# EAGLE board GPU (EAGLE 9.4.2), part 1 of 2
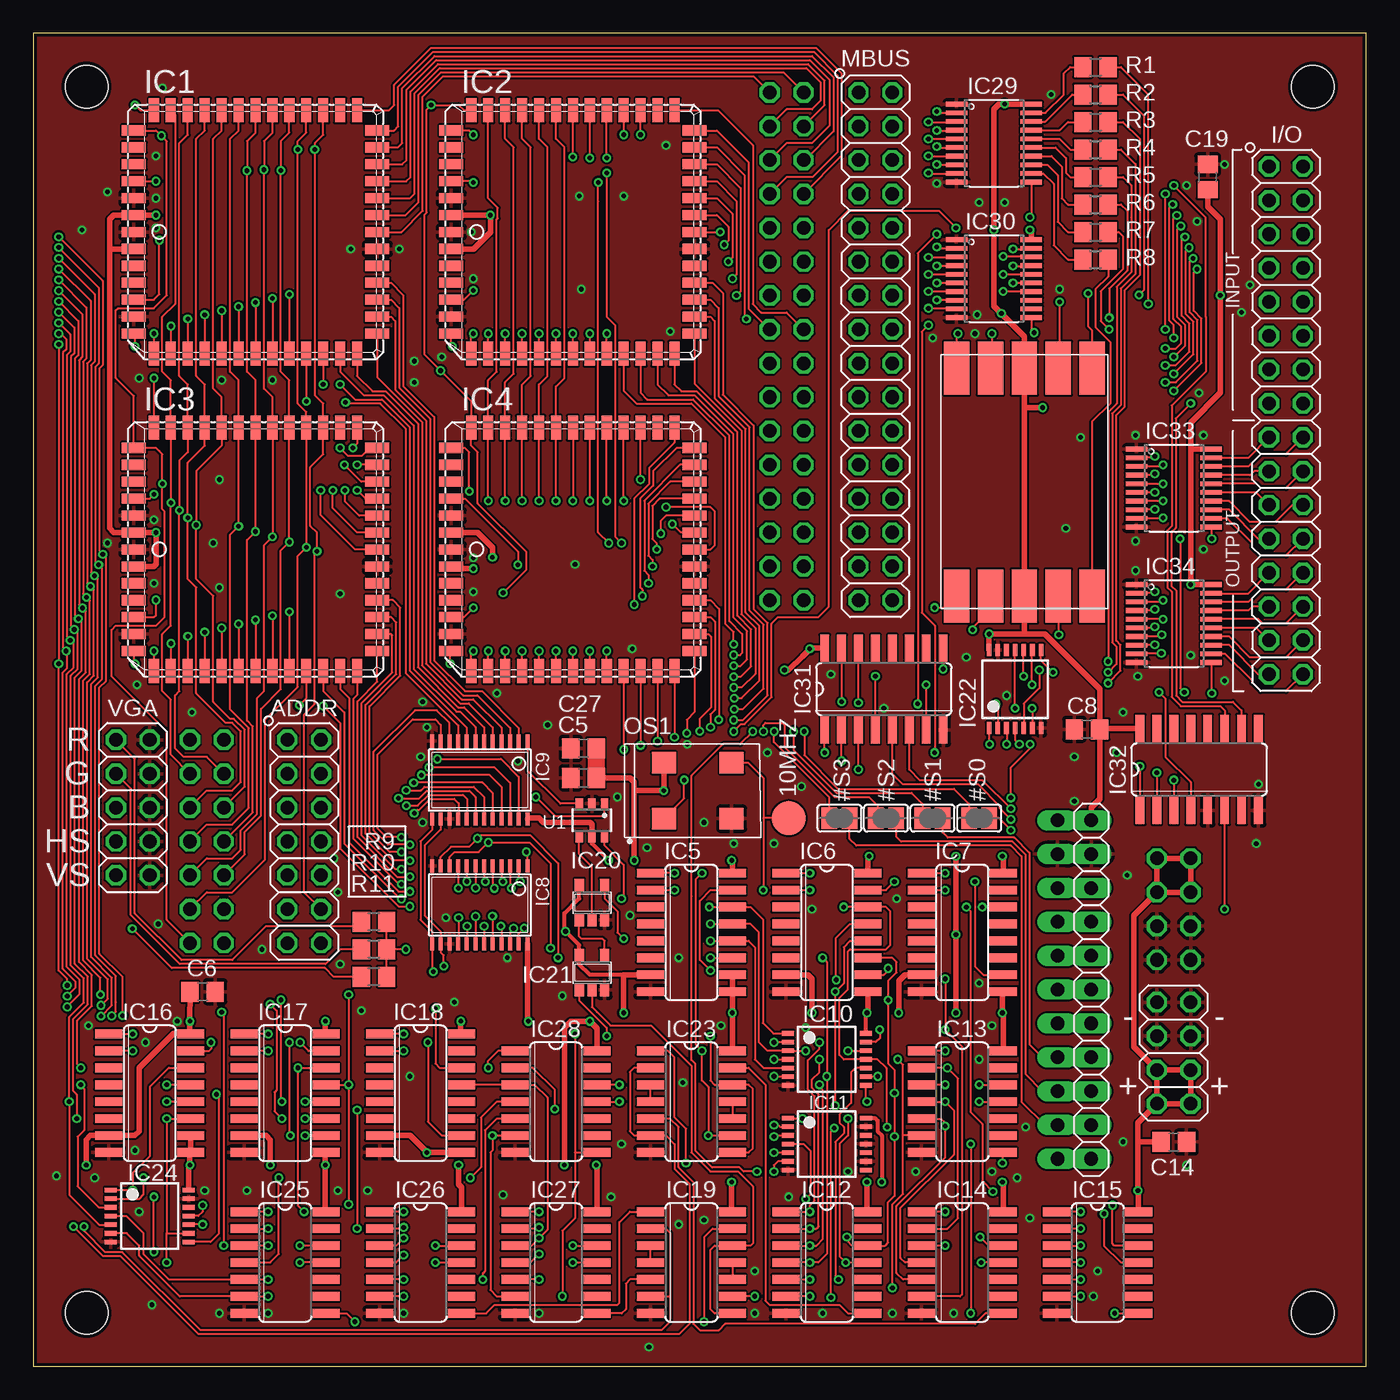
[diagram p5: board, top side]
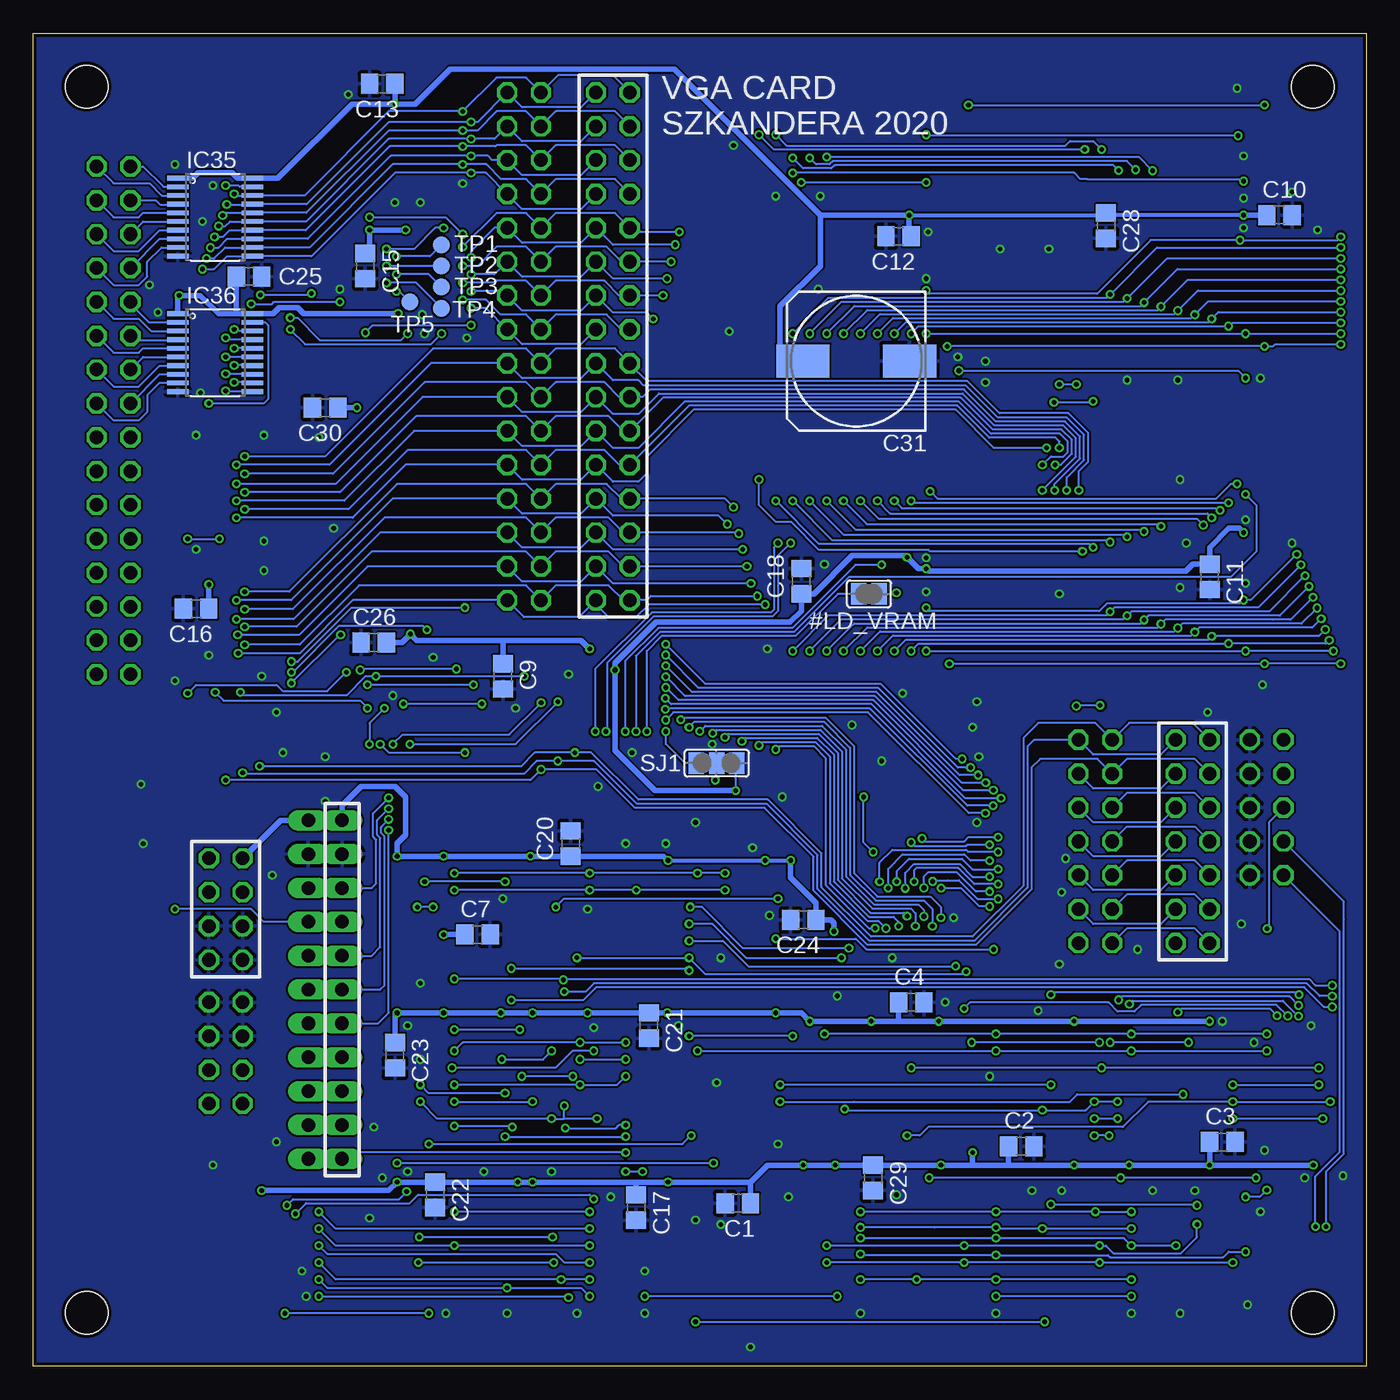
[diagram p6: board, bottom side, seen from below]

Size 100 x 100 mm. Coordinates in mm from the lower left corner, seen from the top.
Outline: 0,0 100,0 100,100 0,100 0,0
Copper layers (1*16): Top 0.035mm / dielectric 1.5mm / Bottom 0.035mm
Design rules "SeeedStudio_2layer_DRU_no_angle_20140221": minimum track width 6mil, minimum drill 12mil, track to track 6mil, track to pad 6mil, pad to pad 6mil, via to via 6mil, smd to smd 0mil, copper to edge 10mil, drill to drill 10mil, minimum pad ring 10mil, minimum via ring 6mil, stop-mask expansion 2mil, vias tented up to drill 100mil, thermal gap 10mil
Holes 3.2 mm at 4,4 96,4 4,96 96,96

## Footprints (pad centres in the part's own frame; a part is rotated, then mirrored left to right if it is on the bottom)
B2,54 = smd 2.54 x 2.54: TP 0,0
SJ = smd 1.168 x 1.6: 1 -0.762,0; 2 0.762,0
2X07 = drill 1.016 octagon: 1 -7.62,-1.27; 2 -7.62,1.27; 3 -5.08,-1.27; 4 -5.08,1.27; 5 -2.54,-1.27; 6 -2.54,1.27; 7 0,-1.27; 8 0,1.27; 9 2.54,-1.27; 10 2.54,1.27; 11 5.08,-1.27; 12 5.08,1.27; 13 7.62,-1.27; 14 7.62,1.27
C0805 = smd 1.3 x 1.5: 1 -0.95,0; 2 0.95,0
153CLV-1010 = smd 4 x 2.5: + 4,0; - -4,0
2X16 = drill 1.016 octagon: 1 -19.05,-1.27; 2 -19.05,1.27; 3 -16.51,-1.27; 4 -16.51,1.27; 5 -13.97,-1.27; 6 -13.97,1.27; 7 -11.43,-1.27; 8 -11.43,1.27; 9 -8.89,-1.27; 10 -8.89,1.27; 11 -6.35,-1.27; 12 -6.35,1.27; 13 -3.81,-1.27; 14 -3.81,1.27; 15 -1.27,-1.27; 16 -1.27,1.27; 17 1.27,-1.27; 18 1.27,1.27; 19 3.81,-1.27; 20 3.81,1.27; 21 6.35,-1.27; 22 6.35,1.27; 23 8.89,-1.27; 24 8.89,1.27; 25 11.43,-1.27; 26 11.43,1.27; 27 13.97,-1.27; 28 13.97,1.27; 29 16.51,-1.27; 30 16.51,1.27; 31 19.05,-1.27; 32 19.05,1.27
L52-1 = smd 1.8 x 0.76: 1 -9.13,0; 2 -9.13,-1.27; 3 -9.13,-2.54; 4 -9.13,-3.81; 5 -9.13,-5.08; 6 -9.13,-6.35; 7 -9.13,-7.62; 21 9.13,-7.62; 22 9.13,-6.35; 23 9.13,-5.08; 24 9.13,-3.81; 25 9.13,-2.54; 26 9.13,-1.27; 27 9.13,0; 28 9.13,1.27; 29 9.13,2.54; 30 9.13,3.81; 31 9.13,5.08; 32 9.13,6.35; 33 9.13,7.62; 47 -9.13,7.62; 48 -9.13,6.35; 49 -9.13,5.08; 50 -9.13,3.81; 51 -9.13,2.54; 52 -9.13,1.27 | smd 0.76 x 1.8: 8 -7.62,-9.13; 9 -6.35,-9.13; 10 -5.08,-9.13; 11 -3.81,-9.13; 12 -2.54,-9.13; 13 -1.27,-9.13; 14 0,-9.13; 15 1.27,-9.13; 16 2.54,-9.13; 17 3.81,-9.13; 18 5.08,-9.13; 19 6.35,-9.13; 20 7.62,-9.13; 34 7.62,9.13; 35 6.35,9.13; 36 5.08,9.13; 37 3.81,9.13; 38 2.54,9.13; 39 1.27,9.13; 40 0,9.13; 41 -1.27,9.13; 42 -2.54,9.13; 43 -3.81,9.13; 44 -5.08,9.13; 45 -6.35,9.13; 46 -7.62,9.13
SO16 = smd 0.66 x 2.032: 1 -4.445,-3.073; 2 -3.175,-3.073; 3 -1.905,-3.073; 4 -0.635,-3.073; 5 0.635,-3.073; 6 1.905,-3.073; 7 3.175,-3.073; 8 4.445,-3.073; 9 4.445,3.073; 10 3.175,3.073; 11 1.905,3.073; 12 0.635,3.073; 13 -0.635,3.073; 14 -1.905,3.073; 15 -3.175,3.073; 16 -4.445,3.073
TSSOP24 = smd 0.305 x 0.991: 1 -3.575,-2.918; 2 -2.925,-2.918; 3 -2.275,-2.918; 4 -1.625,-2.918; 5 -0.975,-2.918; 6 -0.325,-2.918; 7 0.325,-2.918; 8 0.975,-2.918; 9 1.625,-2.918; 10 2.275,-2.918; 11 2.925,-2.918; 12 3.575,-2.918; 13 3.575,2.918; 14 2.925,2.918; 15 2.275,2.918; 16 1.625,2.918; 17 0.975,2.918; 18 0.325,2.918; 19 -0.325,2.918; 20 -0.975,2.918; 21 -1.625,2.918; 22 -2.275,2.918; 23 -2.925,2.918; 24 -3.575,2.918
TSSOP14 = smd 0.35 x 0.9: 1 -1.95,-2.925; 2 -1.3,-2.925; 3 -0.65,-2.925; 4 0,-2.925; 5 0.65,-2.925; 6 1.3,-2.925; 7 1.95,-2.925; 8 1.95,2.925; 9 1.3,2.925; 10 0.65,2.925; 11 0,2.925; 12 -0.65,2.925; 13 -1.3,2.925; 14 -1.95,2.925
SO14 = smd 0.66 x 2.032: 1 -3.81,-3.073; 2 -2.54,-3.073; 3 -1.27,-3.073; 4 0,-3.073; 5 1.27,-3.073; 6 2.54,-3.073; 7 3.81,-3.073; 8 3.81,3.073; 9 2.54,3.073; 10 1.27,3.073; 11 0,3.073; 12 -1.27,3.073; 13 -2.54,3.073; 14 -3.81,3.073
SOT23-5 = smd 0.69 x 0.99: 1 -0.95,-1.29; 2 0,-1.29; 3 0.95,-1.29; 4 0.95,1.3; 5 -0.95,1.3
TSSOP20 = smd 0.35 x 1.6: 1 -2.925,-2.8; 2 -2.275,-2.8; 3 -1.625,-2.8; 4 -0.975,-2.8; 5 -0.325,-2.8; 6 0.325,-2.8; 7 0.975,-2.8; 8 1.625,-2.8; 9 2.275,-2.8; 10 2.925,-2.8; 11 2.925,2.8; 12 2.275,2.8; 13 1.625,2.8; 14 0.975,2.8; 15 0.325,2.8; 16 -0.325,2.8; 17 -0.975,2.8; 18 -1.625,2.8; 19 -2.275,2.8; 20 -2.925,2.8
1X11 = drill 1.016 long: 1 -12.7,0; 2 -10.16,0; 3 -7.62,0; 4 -5.08,0; 5 -2.54,0; 6 0,0; 7 2.54,0; 8 5.08,0; 9 7.62,0; 10 10.16,0; 11 12.7,0
7.2X5.2-4-PAD = smd 1.8 x 1.6: 1 -2.54,-2.1; 2 2.54,-2.1; 3 2.54,2.1; 4 -2.54,2.1
2X04 = drill 1.016 octagon: 1 -3.81,-1.27; 2 -3.81,1.27; 3 -1.27,-1.27; 4 -1.27,1.27; 5 1.27,-1.27; 6 1.27,1.27; 7 3.81,-1.27; 8 3.81,1.27
R0805 = smd 1.3 x 1.5: 1 -0.95,0; 2 0.95,0
SJ_2 = smd 1.168 x 1.6: 1 -1.524,0; 2 0,0; 3 1.524,0
B1,27 = smd 1.27 x 1.27: TP 0,0
SOT457 = smd 0.55 x 0.8: 1 -0.95,-1.25; 2 0,-1.25; 3 0.95,-1.25; 4 0.95,1.25; 5 0,1.25; 6 -0.95,1.25
OPS-S5621YG = smd 1.9 x 4: P$1 1.17,-1; P$2 3.71,-1; P$3 6.25,-1; P$4 8.79,-1; P$5 11.33,-1; P$6 1.17,-18.1; P$7 3.71,-18.1; P$8 6.25,-18.1; P$9 8.79,-18.1; P$10 11.33,-18.1
2X05 = drill 1.016 octagon: 1 -5.08,-1.27; 2 -5.08,1.27; 3 -2.54,-1.27; 4 -2.54,1.27; 5 0,-1.27; 6 0,1.27; 7 2.54,-1.27; 8 2.54,1.27; 9 5.08,-1.27; 10 5.08,1.27

## Placement (x,y rotation side)
10MHZ  PTR1B2,54  [B2,54]  56.67,41.12 0 top
#LD_VRAM  [SJ]  37.31,57.94 0 bottom
#S0  [SJ]  70.96,41.12 180 top
#S1  [SJ]  67.47,41.12 0 top
#S2  [SJ]  63.98,41.12 0 top
#S3  [SJ]  60.48,41.12 0 top
ADDR  [2X07]  13.02,39.37 270 top
ADDR_  [2X07]  20.32,39.37 270 top
C1  [C0805]  47.15,12.22 180 bottom
C2  [C0805]  25.88,16.51 0 bottom
C3  [C0805]  10.79,16.83 0 bottom
C4  [C0805]  34.13,27.3 0 bottom
C5  [C0805]  41.27,44.13 180 top
C6  [C0805]  12.7,28.1 0 top
C7  [C0805]  66.67,32.38 0 bottom
C8  [C0805]  79.06,47.78 180 top
C9  [C0805]  64.77,51.75 270 bottom
C10  [C0805]  6.51,86.36 0 bottom
C11  [C0805]  11.75,59.21 270 bottom
C12  [C0805]  35.08,84.77 180 bottom
C13  [C0805]  73.82,96.2 180 bottom
C14  [C0805]  85.57,16.83 0 top
C15  [C0805]  75.09,82.55 270 bottom
C16  [C0805]  87.79,56.83 180 bottom
C17  [C0805]  54.77,11.91 270 bottom
C18  [C0805]  42.39,58.9 90 bottom
C19  [C0805]  88.11,89.22 90 top
C20  [C0805]  59.69,39.21 90 bottom
C21  [C0805]  53.82,25.56 270 bottom
C22  [C0805]  69.85,12.86 270 bottom
C23  [C0805]  72.87,23.34 270 bottom
C24  [C0805]  42.23,33.5 180 bottom
C25  [C0805]  83.82,81.76 0 bottom
C26  [C0805]  74.45,54.29 180 bottom
C27  1u  [C0805]  41.27,46.35 180 top
C28  1u  [C0805]  19.53,85.57 270 bottom
C29  1u  [C0805]  36.99,14.13 270 bottom
C30  1u  [C0805]  78.11,71.91 180 bottom
C31  [153CLV-1010]  38.26,75.41 180 bottom
I/O  [2X16]  93.98,70.96 270 top
IC1  [L52-1]  16.67,85.09 0 top
IC2  [L52-1]  40.48,85.09 0 top
IC3  [L52-1]  16.67,61.28 0 top
IC4  [L52-1]  40.48,61.28 0 top
IC5  4161D  [SO16]  49.37,32.54 270 top
IC6  4161D  [SO16]  59.53,32.54 270 top
IC7  4161D  [SO16]  69.69,32.54 270 top
IC8  4067  [TSSOP24]  33.5,34.61 180 top
IC9  4067  [TSSOP24]  33.5,43.97 180 top
IC10  7404  [TSSOP14]  59.53,23.02 270 top
IC11  7404  [TSSOP14]  59.53,16.67 270 top
IC12  74AC30D  [SO14]  59.53,7.78 270 top
IC13  74AC30D  [SO14]  69.69,19.84 270 top
IC14  74AC30D  [SO14]  69.69,7.78 270 top
IC15  74AC30D  [SO14]  79.85,7.78 270 top
IC16  4161D  [SO16]  8.73,20.48 270 top
IC17  4161D  [SO16]  18.89,20.48 270 top
IC18  4161D  [SO16]  29.05,20.48 270 top
IC19  74AC00D  [SO14]  49.37,7.78 270 top
IC20  74AHC1G125DBV  [SOT23-5]  41.91,34.77 0 top
IC21  74AHC1G00DBV  [SOT23-5]  41.91,29.53 0 top
IC22  7404  [TSSOP14]  73.66,50.8 0 top
IC23  74AC00D  [SO14]  49.37,19.84 270 top
IC24  7404  [TSSOP14]  8.73,11.27 270 top
IC25  74AC30D  [SO14]  18.89,7.78 270 top
IC26  74AC30D  [SO14]  29.05,7.78 270 top
IC27  74AC30D  [SO14]  39.21,7.78 270 top
IC28  74AC30D  [SO14]  39.21,19.84 270 top
IC29  74574  [TSSOP20]  72.07,91.76 270 top
IC30  74574  [TSSOP20]  72.07,81.6 270 top
IC31  74AC138D  [SO16]  63.82,50.8 0 top
IC32  74AC138D  [SO16]  87.47,44.77 0 top
IC33  74574  [TSSOP20]  85.57,65.88 270 top
IC34  74574  [TSSOP20]  85.57,55.72 270 top
IC35  74245  [TSSOP20]  86.36,86.2 270 bottom
IC36  74245  [TSSOP20]  86.36,76.04 270 bottom
JP2  [1X11]  79.38,28.26 90 top
JP4  [1X11]  76.83,28.26 90 top
MBUS  [2X16]  56.52,76.52 270 top
MBUS1  [2X16]  63.18,76.52 270 top
OS1  OSC-OE-CFPS-72  [7.2X5.2-4-PAD]  49.85,43.18 0 top
PWR  [2X04]  85.57,34.29 270 top
PWR1  [2X04]  85.57,23.5 90 top
R1  [R0805]  79.69,97.47 0 top
R2  [R0805]  79.69,95.41 0 top
R3  [R0805]  79.69,93.34 0 top
R4  [R0805]  79.69,91.28 0 top
R5  [R0805]  79.69,89.22 0 top
R6  [R0805]  79.69,87.15 0 top
R7  [R0805]  79.69,85.09 0 top
R8  [R0805]  79.69,83.03 0 top
R9  [R0805]  25.56,33.34 180 top
R10  [R0805]  25.56,31.27 180 top
R11  [R0805]  25.56,29.21 180 top
SJ1  [SJ_2]  48.74,45.24 0 bottom
TP1  PTR1B1,27  [B1,27]  69.37,84.14 0 bottom
TP2  PTR1B1,27  [B1,27]  69.37,82.55 0 bottom
TP3  PTR1B1,27  [B1,27]  69.37,80.96 0 bottom
TP4  PTR1B1,27  [B1,27]  69.37,79.38 0 bottom
TP5  PTR1B1,27  [B1,27]  71.75,79.85 0 bottom
U1  SN74LVC1G157GV  [SOT457]  41.91,40.96 180 top
U$1  OPS-S5621YG  [OPS-S5621YG]  68.1,75.88 0 top
VGA  [2X05]  7.46,41.91 270 top

## Tracks (layer width: path | path; a pad name or v marks a point on that pad's centre or on a via)
#DISPLAY
  Top 0.152: IC21.4 42.86,31.91 42.7,32.07 41.12,32.07 40.96,32.23 IC20.1
#H0  (via drill 0.35)
  Top 0.152: IC12.1 v58.26,11.59 58.26,12.06 58.62,12.42 58.62,20.25 58.11,20.76 58.11,22.94 58.98,23.8 v58.98,24.29 | v68.42,11.59 IC14.1 | v68.42,23.65 IC13.1 | v55.56,24.29 55.59,24.32 IC10.2
  Bottom 0.152: v58.26,11.59 v68.42,11.59 | v68.42,23.65 67.79,24.29 v58.98,24.29 v55.56,24.29
#H1  (via drill 0.35)
  Top 0.152: IC12.2 v58.26,10.32 58.74,10.32 58.92,10.5 58.92,20.38 58.42,20.88 58.42,21.5 58.98,22.06 v58.98,23.02 | v78.58,11.59 IC15.1 | v55.56,23.02 IC10.4
  Bottom 0.152: v58.26,10.32 77.31,10.32 v78.58,11.59 | v58.98,23.02 v55.56,23.02
#H2  (via drill 0.35)
  Top 0.152: IC12.3 v58.26,9.05 58.74,9.05 59.23,9.54 59.23,20.7 58.98,20.95 v58.98,21.11 | v68.42,9.05 IC14.3 | v78.58,10.32 IC15.2 | v68.42,21.11 IC13.3 | v55.56,21.75 56.58,21.75 IC10.6
  Bottom 0.152: v58.26,9.05 v68.42,9.05 77.31,9.05 v78.58,10.32 | v68.42,21.11 v58.98,21.11 56.2,21.11 v55.56,21.75
#H3  (via drill 0.35)
  Top 0.152: IC13.4 v68.42,19.84 69.06,19.21 69.06,15.88 65.08,11.89 65.08,8.11 65.41,7.78 IC14.4 | v62.55,19.84 62.46,19.93 IC10.8
  Bottom 0.152: v68.42,19.84 v62.55,19.84
#H4  (via drill 0.35)
  Top 0.152: IC12.5 v58.26,6.51 | v78.58,7.78 IC15.4 | IC10.10 61.66,22.37 61.34,22.05 61.34,19.75 60.48,18.89 60.48,18.26 60.8,17.94 60.8,17.46 60.17,16.83 60.17,6.75 v60.41,6.51
  Bottom 0.152: v58.26,6.51 v60.41,6.51 77.31,6.51 v78.58,7.78
#H5  (via drill 0.35)
  Top 0.152: IC15.5 v78.58,6.51 | v58.26,5.24 IC12.6 | v61.12,23.65 61.13,23.67 IC10.12 | v64.45,5.87 64.45,12.13 65.25,12.93 65.25,17.3 | 65.25,17.3 65.25,22.62 v64.85,23.02 | IC13.6 65.25,17.3
  Bottom 0.152: v78.58,6.51 77.95,5.87 v64.45,5.87 58.9,5.87 v58.26,5.24 | v64.85,23.02 61.75,23.02 v61.12,23.65
#H6  (via drill 0.35)
  Top 0.152: IC15.6 v78.58,5.24 | v60.09,17.86 59.85,17.62 v59.85,5.16 | v55.56,18.1 55.88,18.1 56.01,17.97 IC11.2
  Bottom 0.152: v78.58,5.24 59.93,5.24 v59.85,5.16 | v55.56,18.1 56.04,18.1 56.28,17.86 v60.09,17.86
#H7  (via drill 0.35)
  Top 0.152: IC11.4 57.78,16.67 58.31,16.14 58.31,12.91 v57.94,12.54 | v80.33,11.43 80.33,9.05 81.6,7.78 IC15.11
  Bottom 0.152: v80.33,11.43 79.53,12.22 71.75,12.22 71.12,12.86 58.26,12.86 v57.94,12.54
#H_BLANK  (via drill 0.35)
  Top 0.152: IC23.8 53.66,16.03 53.98,16.35 53.98,20.8 53.66,21.11 IC23.12 51.12,21.11 50.8,21.43 50.8,24.45 v50.8,24.77 | IC21.1 40.96,27.46 43.02,25.4 v43.02,24.77
  Bottom 0.152: v43.02,24.77 v50.8,24.77
#H_MR  (via drill 0.35)
  Top 0.152: IC18.2 v27.78,23.65 | v17.62,23.65 IC17.2 | v7.46,23.65 IC16.2 | v48.1,36.99 IC5.1 | v81.12,3.97 IC15.8 | v70.33,16.67 v70.33,3.97 | IC23.9 v50.64,17.3 50.64,20.95 50.16,21.43 v50.16,23.65 49.69,24.13 49.69,36.51 v50.16,36.99 | IC7.1 v68.42,36.99 | IC6.1 v58.26,36.99
  Bottom 0.152: v27.78,23.65 27.62,23.65 | 27.62,23.65 v17.62,23.65 v7.46,23.65 | v48.1,36.99 v50.16,36.99 v58.26,36.99 v68.42,36.99 | v70.33,3.97 v81.12,3.97 | v70.33,16.67 51.28,16.67 v50.64,17.3 | v50.16,23.65 27.62,23.65
#LOAD_VRAM  (via drill 0.35)
  Top 0.152: IC2.46 32.3,94.22 31.91,94.61 v29.84,94.61 29.52,94.28 29.52,86.55 29.37,86.41 29.37,75.88 v30.56,74.69 32.86,72.39 IC4.46 32.86,69.06 33.34,68.58 33.34,64.72 36.99,61.07 36.99,59.77 v35.24,58.02 | v7.62,94.63 8.03,94.22 IC1.46 | v9.05,74.14 IC3.46 | IC11.6 55.85,15.37 55.56,15.08 v55.56,14.61 | v54.29,14.61 53.3,14.61 52.99,14.91 50.93,14.91 49.68,16.16 49.68,22.67 49.37,22.97 49.37,35.24 49.38,35.26 49.38,44.3 51.75,46.67 53.02,46.67 v53.98,47.62
  Bottom 0.152: v29.84,94.61 7.63,94.61 v7.62,94.63 | v30.56,74.69 9.6,74.69 v9.05,74.14 | v55.56,14.61 v54.29,14.61 | v53.98,47.62 53.98,53.66 52.85,54.78 42.81,54.78 39.64,57.94 #LD_VRAM.1 #LD_VRAM.2 35.56,57.94 35.48,58.02 v35.24,58.02
#STORE_VR0  (via drill 0.35)
  Top 0.152: v73.34,40.22 72.44,41.12 #S0.1 #S0.2 70.2,42.2 69.08,43.31 60.37,43.31 57.85,45.84 v57.85,47.62 | IC1.50 v9.21,88.9 | v43.02,89.53 43.02,78.74 43.66,78.11 43.66,62.23 v44.13,61.75
  Top 0.305: JP4.5 JP2.5
  Bottom 0.152: v44.13,61.75 44.45,61.44 44.45,56.76 44.65,56.56 53.59,56.56 57.85,52.3 v57.85,47.62 | JP4.5 74.14,25.72 73.34,26.51 v73.34,40.22 | v9.21,88.9 9.37,89.06 20.95,89.06 21.43,89.06 21.91,89.53 v43.02,89.53
#STORE_VR1  (via drill 0.35)
  Top 0.152: JP4.4 75.72,23.18 74.75,24.16 74.75,38.51 73.59,39.66 68.61,39.66 68.23,40.04 #S1.2 #S1.1 66.71,42.2 65.89,43.01 60.25,43.01 57.04,46.22 v57.04,47.62 | v43.18,61.75 42.39,62.55 42.39,87.39 v42.39,88.82 | v33.02,88.82 32.94,88.9 IC2.50
  Top 0.305: JP2.4 JP4.4
  Bottom 0.152: v43.18,61.75 44.13,60.8 44.13,56.65 44.53,56.26 53.46,56.26 56.95,52.77 56.95,47.72 v57.04,47.62 | v42.39,88.82 v33.02,88.82
#STORE_VR2  (via drill 0.35)
  Top 0.152: IC3.50 8.73,65.09 v9.05,65.41 | v54.78,47.62 54.78,48.12 54.93,48.26 56.2,48.26 56.36,48.1 56.36,46.47 60.12,42.7 62.71,42.7 63.34,42.07 63.34,41.12 | JP4.3 75.72,20.64 74.44,21.92 74.44,38.38 73.47,39.36 65.1,39.36 64.74,39.72 #S2.2 63.34,41.12 | 63.34,41.12 #S2.1
  Top 0.305: JP4.3 JP2.3
  Bottom 0.152: v9.05,65.41 8.26,64.61 8.26,61.12 10.16,59.21 38.8,59.21 42.93,55.09 52.98,55.09 54.78,53.28 v54.78,47.62
#STORE_VR3  (via drill 0.35)
  Top 0.152: IC4.50 32.38,65.09 36.35,61.12 v36.35,60.12 | JP4.2 75.88,18.1 74.14,19.84 74.14,38.26 73.34,39.05 61.75,39.05 61.25,39.56 #S3.2 #S3.1 59.72,42.67 55.56,46.83 55.56,47.6 v55.59,47.62
  Top 0.305: JP2.2 JP4.2
  Bottom 0.152: v36.35,60.12 38.33,60.12 43.06,55.39 53.1,55.39 55.59,52.91 v55.59,47.62
#TO_SP  (via drill 0.35)
  Top 0.152: IC31.4 v63.18,51.75 | v74.3,51.75 74.3,53.71 IC22.10 | v84.45,50.56 84.93,50.09 84.93,45.72 86.84,43.81 IC32.4
  Bottom 0.152: v63.18,51.75 v74.3,51.75 75.09,51.75 76.5,50.34 84.23,50.34 v84.45,50.56
#V0  (via drill 0.35)
  Top 0.152: IC24.2 7.97,12.57 8.26,12.86 v8.26,14.13 | IC28.4 34.77,19.84 33.59,18.66 33.59,14.92 v32.79,14.13 | IC25.4 17.78,7.78 18.41,8.41 v18.41,14.13
  Bottom 0.152: v8.26,14.13 v18.41,14.13 v32.79,14.13
#V1  (via drill 0.35)
  Top 0.152: v17.62,6.51 IC25.5 10.16,6.51 8.26,8.41 8.26,10 6.99,11.27 IC24.4 | v27.78,6.51 IC26.5 | v37.94,6.51 IC27.5 | IC28.5 34.77,18.57 33.89,17.7 33.89,7.14 33.73,6.99 v33.73,6.51
  Bottom 0.152: v17.62,6.51 v27.78,6.51 v33.73,6.51 v37.94,6.51
#V2  (via drill 0.35)
  Top 0.152: v17.62,5.24 IC25.6 11,5.24 7.95,8.29 7.95,9.04 7.01,9.97 IC24.6 | v27.78,5.24 IC26.6
  Bottom 0.152: v17.62,5.24 v27.78,5.24
#V3  (via drill 0.35)
  Top 0.152: IC28.11 v43.97,19.84 | v13.73,20.4 13.89,20.24 13.89,9.92 13.29,9.32 IC24.8
  Bottom 0.152: v43.97,19.84 38.42,19.84 22.23,19.84 21.67,20.4 v13.73,20.4
#V5  (via drill 0.35)
  Top 0.152: IC25.12 v20,9.05 | v30.16,9.05 IC26.12 | v40.48,9.05 IC27.12 | v12.7,10.64 11.75,10.64 11.73,10.62 IC24.10
  Bottom 0.152: v40.48,9.05 v30.16,9.05 v20,9.05 19.53,9.05 18.96,8.48 13.9,8.48 12.7,9.68 v12.7,10.64
#V_BLANK
  Top 0.152: IC19.8 51.12,3.97 50.8,4.29 50.8,8.73 51.12,9.05 IC19.12 53.82,9.05 53.98,9.21 53.98,13.49 52.86,14.61 50.8,14.61 49.37,16.03 49.37,22.54 46.35,25.56 43.29,25.56 42.28,26.57 41.91,26.94 IC21.2
#V_MR  (via drill 0.35)
  Top 0.152: IC16.1 v7.46,24.92 | v17.62,24.92 IC17.1 | v27.78,24.92 IC18.1 | v40.64,24.92 40.64,16.03 | 40.64,16.03 IC28.8 | v54.13,5.24 IC19.9 | 40.64,16.03 40.64,11.11 39.69,10.16 v39.69,5.24
  Bottom 0.152: v7.46,24.92 v17.62,24.92 v27.78,24.92 v40.64,24.92 | v39.69,5.24 v54.13,5.24
CLK  (via drill 0.35)
  Top 0.152: IC5.2 v48.1,35.72 | IC7.2 v68.42,35.72 | IC6.2 v58.26,35.72 | OS1.3 53.62,45.28 54.77,44.13 54.77,41.12 | 10MHZ.TP 54.77,41.12 | 54.77,41.12 v54.77,35.72
  Bottom 0.152: v48.1,35.72 v54.77,35.72 v58.26,35.72 v68.42,35.72
CLK_CPU  (via drill 0.35)
  Top 0.152: JP4.6 JP2.6 | v73.34,41.02 72.54,41.83 72.54,42.01 70.89,43.66 65.25,43.66 64.45,44.45 IC31.5
  Bottom 0.152: JP4.6 73.98,28.26 73.66,28.57 73.66,39.75 73.9,39.99 73.9,40.45 73.34,41 v73.34,41.02
CLK_EN  (via drill 0.35)
  Top 0.152: OS1.1 48.83,42.6 v48.83,43.97
  Bottom 0.152: SJ1.2 48.83,45.15 v48.83,43.97
CLK_EN_S  (via drill 0.35)
  Top 0.152: v52.55,47.62 53.1,48.18 53.37,48.18 55.39,50.2 55.39,55.71 55.88,56.2 58.9,56.2 59.69,56.99 59.69,85.25 61.12,86.68 67.94,86.68 v69.22,85.41 | v73.5,83.82 74.82,83.82 IC30.19
  Bottom 0.152: v69.22,85.41 69.85,85.41 71.44,83.82 v73.5,83.82 | SJ1.1 51.12,45.24 52.55,46.67 v52.55,47.62
COLOR  (via drill 0.35)
  Top 0.152: IC20.4 42.86,35.09 43.81,34.13 43.81,32.54 v44.29,32.07 | 26.51,31.43 R10.1 R9.1 | v27.94,31.27 26.67,31.27 26.51,31.43 | R11.1 26.51,31.43
  Bottom 0.152: v44.29,32.07 40.16,32.07 38.28,32.07 37.49,31.27 v27.94,31.27
COLOR_BLUE  (via drill 0.35)
  Top 0.152: R11.2 22.54,29.21 21.88,29.87 10.38,29.87 v7.43,32.83
  Bottom 0.152: VGA.5 7.3,40.8 7.3,32.95 v7.43,32.83
COLOR_GREEN
  Top 0.152: R10.2 23.02,31.27 21.92,30.18 10.99,30.18 7.32,33.85 7.32,43.33 VGA.3
COLOR_RED
  Top 0.152: VGA.1 7.62,45.56 7.62,33.97 11.11,30.48 14.92,30.48 17.46,33.02 24.61,33.02 R9.2
GND  (via drill 0.35)
  other vias: 43.81,42.7 38.58,48.1 29.21,49.85 29.53,47.94 29.21,40.8 36.35,45.4 46.04,38.89 52.55,39.21 57.63,43.5 58.42,34.29 48.42,30.64 44.77,33.81 39.69,27.78 24.61,26.67 28.26,21.75 35.24,12.86 17.62,3.97 27.78,3.97 37.94,3.97 54.13,3.97 59.21,3.97 54.13,7.14 46.2,1.43 43.34,12.7 56.67,12.7 66.2,14.61 71.91,14.61 74.77,11.11 74.45,17.94 70.96,23.02 71.91,25.56 70.96,28.73 64.77,35.08 57.94,25.4 51.59,25.56 48.74,21.27 64.45,3.97 69.06,3.97 79.53,5.24 7.94,11.59 12.86,13.18 7.62,16.19 8.41,24.29 10.79,25.88 4.13,25.56 9.37,33.18 22.54,38.1 29.05,45.72 50.32,40.8 55.09,46.04 49.05,46.67 59.85,51.91 82.71,61.91 82.87,51.75 87.79,61.28 87.79,69.85 78.58,69.69 70.64,77.47 70.8,78.9 70.96,87.31 72.87,87.31 76.99,80.8 87.31,85.88 86.52,88.58 91.28,81.12 67.79,88.74 67.47,77.15 47.47,91.6 33.02,81.6 32.86,85.09 27.46,83.82 47.78,77.63 23.81,83.82 9.21,90.81 9.21,87.63 9.21,85.41 3.65,85.25 7.94,74.14 5.56,61.75 9.05,63.5 9.05,58.74 33.02,58.1 33.02,60.64 17.94,73.98 14.13,73.98 91.92,43.66 78.11,42.39 63.82,49.37 70.01,53.18 77.47,62.87 44.93,53.82 34.77,50.48 55.56,39.21 73.03,50.32 86.84,53.34 82.71,59.69 82.71,69.85 76.36,95.41 31.59,27.3 30.96,33.66 35.56,30.64 4.6,14.13 13.97,3.97 25.08,13.18 22.86,13.18 48.42,10.64 50.32,10.95 73.82,14.13 89.38,90.17 90.65,79.06 87.47,73.03 78.11,45.72 61.12,14.61 40.64,60.17 13.97,66.52 13.49,61.75 13.97,58.42 23.02,57.94 11.91,49.05 22.86,35.56 23.02,30.16 17.14,31.27 44.13,16.67 16.03,13.18 8.89,4.6 1.75,14.29 79.85,7.14 86.52,15.08 81.76,16.83 82.07,36.83 91.76,39.21 81.28,46.04 81.76,49.05 89.38,51.44 9.68,95.89 5.56,88.11 7.78,51.12 40.96,87.79 44.29,87.79 41.12,80.8 28.57,75.41 28.57,73.82 30.64,75.72
  pour Top: -4.13,107.16 105.57,107.16 105.57,48.58 105.57,-4.76 32.38,-4.76 -4.13,-4.76
  pour Bottom: -4.76,107.63 107.47,107.63 107.47,11.27 107.47,-6.51 20.16,-6.51 -4.76,-6.51
H0  (via drill 0.35)
  Top 0.152: IC5.14 52.7,34.45 | 52.7,34.45 53.82,34.45 54.45,33.81 54.74,33.52 54.74,25.74 55.52,24.97 IC10.1 | IC9.10 31.22,48.26 30.27,49.21 28.64,49.21 25.53,46.1 25.53,40.21 26.61,39.13 v28.26,39.13 | IC8.10 31.22,38.21 31.59,38.58 33.42,38.58 v34.13,39.29 37.23,39.29 38.81,37.71 v38.81,31.36 | v50.72,34.45 52.7,34.45
  Bottom 0.152: v34.13,39.29 33.88,39.04 30,39.04 29.91,39.13 v28.26,39.13 | v38.81,31.36 46.75,31.36 49.84,34.45 v50.72,34.45
H1  (via drill 0.35)
  Top 0.152: IC14.2 68.58,10.32 69.37,11.11 69.37,21.59 v68.58,22.38 IC13.2 | v57.94,23.65 57.93,23.67 IC10.3 55.07,23.67 54.44,24.3 54.44,32.56 53.82,33.18 IC5.13 v50.8,33.18 | IC8.11 30.57,38.19 31.34,38.96 32.69,38.96 v33.32,39.6 33.58,39.85 37.26,39.85 39.37,37.74 v39.37,30.64 | v27.62,39.69 26.48,39.69 25.84,40.33 25.84,45.9 28.46,48.53 30.16,48.53 30.57,48.12 IC9.11
  Bottom 0.152: v57.94,23.65 59.53,23.65 60.8,22.38 61.91,22.38 v68.58,22.38 | v33.32,39.6 33.1,39.37 30.16,39.37 29.84,39.69 v27.62,39.69 | v39.37,30.64 46.51,30.64 49.05,33.18 v50.8,33.18
H2  (via drill 0.35)
  Top 0.152: IC10.5 54.78,22.37 54.13,23.02 54.13,31.43 53.66,31.91 IC5.12 v50.8,31.91 | IC9.14 30.57,40.26 29.37,39.05 29.37,33.81 30.57,32.61 IC8.14 30.57,31.05 30.8,30.83 v30.8,30
  Bottom 0.152: v50.8,31.91 48.26,31.91 46.36,30 v30.8,30
H3  (via drill 0.35)
  Top 0.152: IC15.3 v78.58,9.05 | IC12.4 v58.26,7.78 58.9,7.78 59.53,8.41 v59.53,21.75 59.53,30.32 v59.21,30.64 | v63.34,21.75 63.31,21.72 IC10.9 | v50.8,30.64 IC5.11 | IC9.13 29.92,40.24 29.05,39.37 29.05,33.5 29.92,32.63 IC8.13 29.92,29.69 v30,29.61
  Bottom 0.152: v78.58,9.05 77.95,8.41 60.8,8.41 60.17,7.78 v58.26,7.78 | v59.53,21.75 v63.34,21.75 | v59.21,30.64 v50.8,30.64 49.61,29.45 30.16,29.45 v30,29.61
H4  (via drill 0.35)
  Top 0.152: IC13.5 68.1,18.57 68.42,18.26 v68.42,18.02 68.42,15.67 64.77,12.02 64.77,6.99 65.25,6.51 IC14.5 | v64.06,17.94 63.99,18 63.99,22.37 63.34,23.02 IC10.11 60.8,23.02 60.47,23.35 60.47,27.62 61.11,28.25 61.11,31.1 61.28,31.27 63.98,31.27 64.29,31.59 64.29,34.13 63.98,34.45 IC6.14 v60.8,34.45 | v44.13,35.08 44.29,35.24 44.29,37.62 42.86,39.05 U1.6
  Bottom 0.152: v68.42,18.02 64.13,18.02 v64.06,17.94 | v60.8,34.45 60.17,35.08 v44.13,35.08
H5  (via drill 0.35)
  Top 0.152: IC1.7 7.62,77.39 v7.62,76.52 | v31.43,76.52 31.35,76.6 IC2.7 | IC3.7 7.54,52.79 v7.62,52.7 | v31.27,52.7 31.27,53.58 IC4.7 | v1.91,76.66 v1.91,52.7 1.91,29.69 2.54,29.05 v2.54,28.57 | v63.5,25.24 63.5,24.61 63.21,24.32 IC10.13 | IC14.6 69.53,5.24 69.68,5.38 69.68,23.98 v68.42,25.24 v68.42,29.05 | v60.23,28.99 60.23,32.13 61.28,33.18 IC6.13
  Bottom 0.152: v31.43,76.52 v7.62,76.52 6.97,76.52 6.83,76.66 v1.91,76.66 | v1.91,52.7 v7.62,52.7 v31.27,52.7 | v2.54,28.57 3.81,28.57 4.29,29.05 60.17,29.05 v60.23,28.99 60.3,29.05 v68.42,29.05 | v63.5,25.24 v68.42,25.24
H6  (via drill 0.35)
  Top 0.152: IC2.8 32.86,77.31 v33.02,77.47 | v9.05,77.47 IC1.8 | IC4.8 32.86,53.5 v33.02,53.66 | v9.05,53.66 IC3.8 | v1.91,77.47 2.06,77.47 2.46,77.07 2.46,76.28 2.21,76.03 2.21,53.91 v2.46,53.66 2.54,53.58 2.54,52.39 2.21,52.06 2.21,29.81 3.17,28.85 3.17,28.4 v2.54,27.77 | IC14.11 v71.12,7.78 | IC12.11 v60.96,7.78 60.48,8.26 60.48,16.67 61.12,17.3 v61.12,18.57 | v70.96,19.84 IC13.11 | v57.7,18.57 56.65,18.57 IC11.1 | IC6.12 61.28,31.91 60.8,31.43 60.8,28.73 v60.17,28.1 60.17,26.99 v60.17,19.53
  Bottom 0.152: v33.02,77.47 v9.05,77.47 v1.91,77.47 | v33.02,53.66 v9.05,53.66 v2.46,53.66 | v2.54,27.77 3.49,27.77 4.46,28.73 57.94,28.73 58.58,28.1 v60.17,28.1 | v71.12,7.78 v60.96,7.78 | v70.96,19.84 69.69,18.57 v61.12,18.57 60.17,18.57 | v57.7,18.57 60.17,18.57 | 60.17,18.57 v60.17,19.53
H7  (via drill 0.35)
  Top 0.152: IC2.9 v34.13,77.47 | v10.32,78.03 IC1.9 | IC4.9 v34.13,53.66 | v10.32,54.21 IC3.9 | v1.91,78.28 2.77,77.42 2.77,76.11 2.52,75.86 2.52,54.72 v2.77,54.47 3.02,54.21 3.02,52.43 2.52,51.93 2.52,29.94 3.48,28.97 3.48,27.92 2.54,26.98 v2.54,26.96 | v71.04,9.68 71.68,9.05 IC14.12 | v55.56,17.23 55.66,17.32 IC11.3 | v70.96,21.11 IC13.12 | v61.04,9.68 61.04,9.45 61.44,9.05 IC12.12 63.9,9.05 64.14,9.29 64.14,12.3 64.61,12.78 v64.61,17.23 v64.61,20.48 64.61,22.23 64.14,22.7 v64.14,27.46 64.14,28.89 64.77,29.53 64.77,30.32 64.45,30.64 IC6.11
  Bottom 0.152: v34.13,77.47 33.58,78.03 v10.32,78.03 10.25,78.03 10,78.28 v1.91,78.28 | v34.13,53.66 33.58,54.21 v10.32,54.21 3.02,54.21 v2.77,54.47 | v64.61,17.23 v55.56,17.23 | v64.61,20.48 70.33,20.48 v70.96,21.11 | v61.04,9.68 v71.04,9.68 | v64.14,27.46 58.74,27.46 57.77,28.43 4.64,28.43 3.17,26.96 v2.54,26.96
H8  (via drill 0.35)
  Top 0.152: IC15.12 81.12,9.05 80.96,9.21 80.96,12.05 v80.98,12.06 | v71.99,13.1 71.2,13.89 71.2,18.18 70.33,19.05 70.33,34.13 v70.01,34.45 | v71.2,34.45 IC7.14
  Bottom 0.152: v80.98,12.06 80.51,12.53 72.56,12.53 v71.99,13.1 | v70.01,34.45 v71.2,34.45
H_COMP_0
  Top 0.152: IC23.13 53.66,22.38 54.93,21.11 54.93,4.92 55.24,4.6 60.48,4.6 61.12,3.97 IC12.8
H_COMP_1  (via drill 0.35)
  Top 0.152: IC13.8 72.71,15.98 v72.71,15.24 | v48.98,15.24 48.98,17.81 48.1,18.69 48.1,23.18 47.62,23.65 IC23.1
  Bottom 0.152: v72.71,15.24 v48.98,15.24
H_COMP_2
  Top 0.152: IC14.8 71.44,3.97 70.64,3.17 51.91,3.17 51.44,2.7 50.01,2.7 49.53,3.17 49.53,13.81 48.42,14.92 48.42,17.94 47.78,18.57 IC23.5
H_SYNC  (via drill 0.35)
  Top 0.152: IC23.2 45.09,22.38 44.77,22.07 44.77,17.62 45.09,17.3 IC23.6 47.47,17.3 48.11,16.66 48.11,14.8 49.21,13.7 49.21,3.17 48.43,2.39 12.41,2.39 6.55,8.26 5.22,8.26 v3,10.48
  Bottom 0.152: v3,10.48 3,14.62 1.68,15.94 1.68,33.5 1.68,34.86 VGA.7
H_SYNC1
  Top 0.152: IC23.11 IC23.10
H_SYNC2
  Top 0.152: IC19.11 IC19.10
INPP_EN_0  (via drill 0.35)
  Top 0.152: v85.57,88.58 87.95,86.2 87.95,78.74 87.95,74.62 85.41,72.07 85.41,63.02 85.09,62.71 85.09,58.42 85.41,58.1 85.41,50.21 86.09,49.53 89.06,49.53 89.38,49.21 IC32.11
  Bottom 0.152: IC35.19 84.51,88.48 84.61,88.58 v85.57,88.58
INPP_EN_1  (via drill 0.35)
  Top 0.152: v86.84,72.23 85.71,71.11 85.71,62.9 85.39,62.58 85.39,58.55 85.74,58.2 85.74,50.31 86.2,49.85 90.01,49.85 90.65,49.21 IC32.10
  Bottom 0.152: IC36.19 82.6,78.32 82.39,78.11 82.39,72.55 82.71,72.23 v86.84,72.23
LOAD  (via drill 0.35)
  Top 0.152: v89.38,34.29 IC32.6
  Top 0.305: JP2.8 JP4.8
  Bottom 0.152: JP2.8 82.71,33.34 83.66,34.29 v89.38,34.29
LOAD_VRAM  (via drill 0.35)
  Top 0.152: IC11.5 55.58,16.02 v55.56,16.03
  Top 0.305: JP4.1 JP2.1
  Bottom 0.152: v55.56,16.03 76.36,16.03 JP4.1
LOWER_BIT
  Top 0.152: IC9.1 37.09,46.88 37.09,44.67 39.55,42.21 U1.3
MB0  (via drill 0.35)
  Top 0.152: IC1.27 27.62,85.09 29.21,86.68 29.21,95.25 30.73,96.77 54.04,96.77 MBUS.1 | v67.79,94.14 67.89,94.03 IC29.2 | v84.93,77.79 v84.93,87.95
  Bottom 0.152: MBUS.1 56.52,96.84 60.64,96.84 MBUS1.1 63.02,96.68 65.25,96.68 v67.79,94.14 73.34,94.14 79.66,87.83 IC35.18 84.81,87.83 v84.93,87.95 | IC36.18 84.81,77.67 v84.93,77.79
MB1  (via drill 0.35)
  Top 0.152: IC1.28 27.94,86.36 28.91,87.33 28.91,95.38 30.61,97.08 56.27,97.08 MBUS.2 | v67.15,93.34 69.23,93.34 IC29.3 | v85.57,77.15 85.57,78.11 85.24,78.44 85.24,86.9 v85.49,87.15
  Bottom 0.152: MBUS.2 58.91,94.44 63.33,94.44 MBUS1.2 66.67,93.34 v67.15,93.34 73.34,93.34 79.51,87.18 IC35.17 83.58,87.15 v85.49,87.15 | IC36.17 85.43,77.02 v85.57,77.15
MB2  (via drill 0.35)
  Top 0.152: IC1.29 28.26,87.63 28.6,87.97 28.6,95.5 30.48,97.38 58,97.38 59.07,96.32 59.07,94.94 58.42,94.3 56.52,94.3 MBUS.3 | v67.79,92.71 69.25,92.71 IC29.4 | v84.93,76.36 85.72,76.36 86.12,76.76 86.12,77.98 85.54,78.56 85.54,86.09 v85.79,86.35
  Bottom 0.152: MBUS.3 56.36,94.14 60.8,94.14 MBUS1.3 63.02,94.14 65.25,94.14 66.67,92.71 v67.79,92.71 73.34,92.71 79.53,86.53 IC35.16 85.61,86.53 v85.79,86.35 | IC36.16 v84.92,76.37 v84.93,76.36
MB3  (via drill 0.35)
  Top 0.152: IC1.30 27.98,88.9 28.3,89.22 28.3,95.63 30.36,97.69 58.13,97.69 59.37,96.44 59.37,94.61 MBUS.4 | v67.15,92.08 IC29.5 | v85.57,75.72 86.43,76.58 86.43,78.11 85.85,78.69 85.85,85.29 v86.1,85.54
  Bottom 0.152: MBUS.4 58.91,91.9 63.33,91.9 MBUS1.4 65.41,92.08 v67.15,92.08 73.34,92.08 79.54,85.88 IC35.15 85.25,85.88 85.59,85.54 v86.1,85.54 | IC36.15 v85.57,75.72
MB4  (via drill 0.35)
  Top 0.152: IC1.31 27.67,90.17 27.99,90.49 27.99,95.75 30.23,97.99 58.26,97.99 59.73,96.52 59.73,93.07 58.42,91.76 56.52,91.76 MBUS.5 | v67.79,91.52 67.87,91.43 IC29.6 | v86.4,84.73 86.15,84.48 86.15,78.81 86.73,78.23 86.73,76.1 85.72,75.09 v84.93,75.09
  Bottom 0.152: MBUS.5 56.36,91.6 60.8,91.6 MBUS1.5 63.02,91.6 65.25,91.6 65.33,91.52 v67.79,91.52 73.26,91.52 79.56,85.23 IC35.14 85.27,85.23 85.77,84.73 v86.4,84.73 | IC36.14 83.58,75.09 v84.93,75.09
MB5  (via drill 0.35)
  Top 0.152: IC1.32 27.37,91.44 27.69,91.76 27.69,95.88 30.1,98.3 58.43,98.3 60.03,96.7 60.03,92.64 57.88,90.49 MBUS.6 | v67.15,90.81 67.17,90.78 IC29.7 | v85.57,74.45 87.04,75.92 87.04,78.36 86.45,78.94 86.45,83.67 v86.71,83.92
  Bottom 0.152: MBUS.6 58.91,89.36 63.33,89.36 MBUS1.6 65.56,90.49 65.88,90.81 v67.15,90.81 73.18,90.81 79.41,84.58 IC35.13 85.44,84.58 86.1,83.92 v86.71,83.92 | IC36.13 85.53,74.42 v85.57,74.45
MB6  (via drill 0.35)
  Top 0.152: IC1.33 27.06,92.71 27.38,93.03 27.38,96.01 29.98,98.6 58.56,98.6 60.34,96.83 60.34,91.09 58.47,89.22 56.52,89.22 MBUS.7 | v67.79,90.17 67.82,90.13 IC29.8 | v84.93,73.82 85.72,73.82 87.34,75.44 87.34,78.48 86.76,79.07 86.76,82.87 v87.01,83.12
  Bottom 0.152: MBUS.7 56.36,89.06 60.8,89.06 MBUS1.7 63.02,89.06 64.9,89.06 66.01,90.17 v67.79,90.17 73.03,90.17 79.27,83.93 IC35.12 85.62,83.93 86.43,83.12 v87.01,83.12 | IC36.12 83.61,73.82 v84.93,73.82
MB7  (via drill 0.35)
  Top 0.152: IC1.34 26.68,94.22 27.08,94.61 27.08,96.13 29.85,98.91 58.73,98.91 60.64,97 60.64,90.81 MBUS.8 | v67.15,89.53 67.2,89.48 IC29.9 | v85.57,73.18 87.65,75.26 87.65,78.61 87.06,79.19 87.06,82.06 v87.32,82.31
  Bottom 0.152: MBUS.8 58.91,86.82 63.33,86.82 MBUS1.8 66.04,89.53 v67.15,89.53 72.87,89.53 79.12,83.28 IC35.11 85.47,83.28 86.44,82.31 v87.32,82.31 | IC36.11 85.5,73.12 v85.57,73.18
MB8  (via drill 0.35)
  Top 0.152: IC2.27 v51.54,85.09 | v67.79,83.98 67.89,83.87 IC30.2
  Bottom 0.152: v51.54,85.09 54.93,85.09 MBUS.9 56.36,86.52 60.8,86.52 MBUS1.9 63.02,86.52 65.25,86.52 v67.79,83.98
MB9  (via drill 0.35)
  Top 0.152: IC2.28 51.28,86.36 52.15,85.49 52.15,84.44 v51.84,84.14 | v67.15,83.19 67.19,83.22 IC30.3
  Bottom 0.152: v51.84,84.14 56.52,84.14 MBUS.10 58.91,84.28 63.33,84.28 MBUS1.10 65.41,85.41 67.15,83.66 v67.15,83.19
MB10  (via drill 0.35)
  Top 0.152: IC2.29 51.28,87.63 52.45,86.45 52.45,83.17 v52.15,82.87 | v67.79,82.55 67.81,82.57 IC30.4
  Bottom 0.152: v52.15,82.87 MBUS.11 55.88,82.87 56.99,83.98 60.8,83.98 MBUS1.11 63.02,83.98 65.25,83.98 66.67,82.55 v67.79,82.55
MB11  (via drill 0.35)
  Top 0.152: IC2.30 51.28,88.9 52.76,87.42 52.76,81.9 v52.45,81.6 | v67.15,81.92 IC30.5
  Bottom 0.152: v52.45,81.6 56.52,81.6 MBUS.12 58.91,81.74 63.33,81.74 MBUS1.12 65.41,81.92 v67.15,81.92
MB12  (via drill 0.35)
  Top 0.152: IC2.31 51.28,90.17 53.06,88.39 53.06,80.63 v52.76,80.33 | v67.79,81.28 IC30.6
  Bottom 0.152: v52.76,80.33 MBUS.13 56.04,80.33 57.15,81.44 60.8,81.44 MBUS1.13 63.02,81.44 65.22,81.44 65.38,81.28 v67.79,81.28
MB13  (via drill 0.35)
  Top 0.152: IC2.32 51.28,91.44 53.37,89.35 53.37,78.72 v53.5,78.58 | v67.15,80.64 69.25,80.64 IC30.7
  Bottom 0.152: v53.5,78.58 53.98,79.06 56.52,79.06 MBUS.14 58.91,79.2 63.33,79.2 MBUS1.14 64.77,80.64 v67.15,80.64
MB14  (via drill 0.35)
  Top 0.152: IC2.33 51.28,92.71 53.67,90.32 53.67,79.36 MBUS.15 | v67.79,80.01 69.23,80.01 IC30.8
  Bottom 0.152: MBUS.15 55.88,77.79 56.99,78.9 60.8,78.9 MBUS1.15 63.02,78.9 64.93,78.9 66.04,80.01 v67.79,80.01
MB15  (via drill 0.35)
  Top 0.152: IC2.34 51.35,94.22 53.98,91.6 53.98,79.69 54.61,79.06 56.52,79.06 MBUS.16 | v67.15,79.38 69.22,79.38 IC30.9
  Bottom 0.152: MBUS.16 58.91,76.66 63.33,76.66 MBUS1.16 66.04,79.38 v67.15,79.38
MB16  (via drill 0.35)
  Top 0.152: IC3.27 24.13,61.28 21.56,63.84 v21.56,65.72 | v84.14,68.26 84.03,68.16 IC33.2
  Bottom 0.152: v21.56,65.72 21.56,67.15 20.86,67.86 20.86,70 22.35,71.49 27.52,71.49 29.91,73.89 53.98,73.89 55.24,75.16 MBUS.17 56.36,76.36 60.8,76.36 MBUS1.17 63.02,76.36 70.01,76.36 78.11,68.26 v84.14,68.26
MB17  (via drill 0.35)
  Top 0.152: IC3.28 24.29,62.55 22.47,64.36 v22.47,65.72 | v84.77,67.63 84.65,67.51 IC33.3
  Bottom 0.152: v22.47,65.72 22.47,66.68 21.16,67.98 21.16,69.88 22.47,71.19 27.64,71.19 30.04,73.58 54.22,73.58 54.61,73.98 56.52,73.98 MBUS.18 58.91,74.12 63.33,74.12 MBUS1.18 70.17,75.25 77.79,67.63 v84.77,67.63
MB18  (via drill 0.35)
  Top 0.152: IC3.29 24.45,63.82 23.38,64.89 v23.38,65.72 | v84.14,66.95 84.04,66.86 IC33.4
  Bottom 0.152: v23.38,65.72 23.38,66.2 21.47,68.11 21.47,69.75 22.6,70.88 27.77,70.88 30.17,73.28 53.72,73.28 54.29,72.71 MBUS.19 56.04,72.71 57.15,73.82 60.8,73.82 MBUS1.19 63.02,73.82 70.64,73.82 77.51,66.95 v84.14,66.95
MB19  (via drill 0.35)
  Top 0.152: IC3.30 24.92,65.09 v24.29,65.72 | v84.77,66.2 82.77,66.2 IC33.5
  Bottom 0.152: v24.29,65.72 21.77,68.24 21.77,69.63 22.73,70.58 27.9,70.58 30.29,72.97 53.07,72.97 54.61,71.44 56.52,71.44 MBUS.20 58.91,71.58 63.33,71.58 MBUS1.20 70.8,72.71 77.31,66.2 v84.77,66.2
MB20  (via drill 0.35)
  Top 0.152: IC3.31 24.61,66.36 v23.34,67.63 | v84.14,65.56 v84.13,65.56 IC33.6
  Bottom 0.152: v23.34,67.63 22.91,67.63 22.08,68.45 22.08,69.5 22.85,70.27 28.02,70.27 30.42,72.67 52.74,72.67 MBUS.21 55.72,70.17 56.83,71.28 60.8,71.28 MBUS1.21 63.02,71.28 71.28,71.28 76.99,65.56 v84.14,65.56
MB21  (via drill 0.35)
  Top 0.152: IC3.32 v24.29,67.63 | v84.77,64.93 84.75,64.91 IC33.7
  Bottom 0.152: v24.29,67.63 23.65,68.26 22.7,68.26 22.38,68.58 22.38,69.37 22.98,69.97 28.15,69.97 30.55,72.36 51.14,72.36 54.61,68.9 56.52,68.9 MBUS.22 58.91,69.04 63.33,69.04 MBUS1.22 71.44,70.17 76.68,64.93 v84.77,64.93
MB22  (via drill 0.35)
  Top 0.152: IC3.33 25.24,68.9 24.63,68.29 23.63,68.29 v23.02,68.9 | v84.14,64.29 84.1,64.26 IC33.8
  Bottom 0.152: v23.02,68.9 23.02,69.37 23.31,69.66 28.27,69.66 30.67,72.06 50.81,72.06 MBUS.23 56.04,67.63 57.15,68.74 60.8,68.74 MBUS1.23 63.02,68.74 71.91,68.74 76.36,64.29 v84.14,64.29
MB23  (via drill 0.35)
  Top 0.152: IC3.34 24.29,69.22 v23.97,68.9 | v84.77,63.66 84.72,63.61 IC33.9
  Bottom 0.152: v23.97,68.9 27.94,68.9 30.8,71.75 50.48,71.75 53.98,68.26 53.98,66.99 54.61,66.36 56.52,66.36 MBUS.24 58.91,66.5 63.33,66.5 MBUS1.24 72.07,67.63 76.04,63.66 v84.77,63.66
MB24  (via drill 0.35)
  Top 0.152: IC4.27 50.8,61.28 51.13,61.61 51.13,64.12 50.8,64.45 v47.47,64.45 | v84.14,58.1 84.03,58 IC34.2
  Bottom 0.152: v47.47,64.45 48.1,65.09 MBUS.25 55.88,65.09 56.99,66.2 60.8,66.2 MBUS1.25 63.02,66.2 72.71,66.2 80.8,58.1 v84.14,58.1
MB25  (via drill 0.35)
  Top 0.152: IC4.28 48.58,62.55 v47.94,63.18 | v84.77,57.47 84.65,57.35 IC34.3
  Bottom 0.152: v47.94,63.18 48.58,63.82 56.52,63.82 MBUS.26 58.91,63.96 63.33,63.96 MBUS1.26 73.03,65.09 80.64,57.47 v84.77,57.47
MB26  (via drill 0.35)
  Top 0.152: IC4.29 47.47,63.82 47.07,63.42 v47.07,62.47 | v84.14,56.79 84.04,56.7 IC34.4
  Bottom 0.152: v47.07,62.47 47.15,62.55 MBUS.27 55.72,62.55 56.83,63.66 60.8,63.66 MBUS1.27 63.02,63.66 73.66,63.66 80.53,56.79 v84.14,56.79
MB27  (via drill 0.35)
  Top 0.152: IC4.30 46.99,65.09 46.45,64.55 46.45,62.07 46.77,61.75 v46.77,61.28 | v84.77,56.04 IC34.5
  Bottom 0.152: v46.77,61.28 56.52,61.28 MBUS.28 58.91,61.42 63.33,61.42 MBUS1.28 73.98,62.55 80.49,56.04 v84.77,56.04
MB28  (via drill 0.35)
  Top 0.152: IC4.31 47.78,66.36 46.14,64.72 46.14,60.8 46.46,60.48 v46.46,60.01 | v84.14,55.48 84.05,55.4 IC34.6
  Bottom 0.152: v46.46,60.01 MBUS.29 55.72,60.01 56.83,61.12 60.8,61.12 MBUS1.29 63.02,61.12 74.61,61.12 80.25,55.48 v84.14,55.48
MB29  (via drill 0.35)
  Top 0.152: IC4.32 48.54,67.63 45.84,64.93 45.84,59.69 46.16,59.37 v46.16,58.74 | v84.67,54.87 84.54,54.75 IC34.7
  Bottom 0.152: v46.16,58.74 56.52,58.74 MBUS.30 58.91,58.88 63.33,58.88 MBUS1.30 74.93,60.01 80.06,54.87 v84.67,54.87
MB30  (via drill 0.35)
  Top 0.152: IC4.33 48.26,68.9 46.5,67.14 46.5,66.06 45.53,65.09 45.53,58.42 45.69,58.26 v45.69,57.78 | v84.14,54.13 84.1,54.1 IC34.8
  Bottom 0.152: v45.69,57.78 53.66,57.78 53.98,57.47 MBUS.31 55.72,57.47 56.83,58.58 60.8,58.58 MBUS1.31 63.02,58.58 75.56,58.58 80.01,54.13 v84.14,54.13
MB31  (via drill 0.35)
  Top 0.152: IC4.34 48.1,69.3 46.2,67.39 46.2,66.2 45.09,65.09 v45.09,57.15 | v84.63,53.48 82.8,53.48 IC34.9
  Bottom 0.152: v45.09,57.15 53.82,57.15 54.77,56.2 56.83,56.2 57.78,57.15 MBUS.32 59.05,56.2 63.18,56.2 MBUS1.32 76.04,57.47 80.03,53.48 v84.63,53.48
N$1
  Top 0.152: IC23.4 IC23.3
N$2  (via drill 0.35)
  Top 0.152: IC5.15 52.39,35.66 52.34,35.72 50.8,35.72 50.01,34.92 50.01,30.48 v50.8,29.69 | IC6.10 63.82,29.37 64.14,29.69 v64.14,29.84
  Bottom 0.152: v64.14,29.84 50.96,29.84 v50.8,29.69
N$3  (via drill 0.35)
  Top 0.152: IC6.15 63.98,35.72 v64.61,36.35 | v70.64,36.35 70.64,30 71.28,29.37 IC7.10
  Bottom 0.152: v64.61,36.35 v70.64,36.35
N$4  (via drill 0.35)
  Top 0.152: IC16.15 13.18,23.65 13.34,23.81 v13.34,24.29 | v19.21,24.29 19.21,17.38 v19.29,17.3 | v20.4,17.3 IC17.10
  Bottom 0.152: v19.29,17.3 v20.4,17.3 | v13.34,24.29 v19.21,24.29
N$5  (via drill 0.35)
  Top 0.152: IC17.15 20.65,23.65 v20.02,24.29 | v29.61,24.29 29.61,18.34 30.64,17.3 IC18.10
  Bottom 0.152: v20.02,24.29 v29.61,24.29
N$6
  Top 0.152: IC19.4 IC19.3
N$7
  Top 0.152: IC20.2 41.91,37.47 40.96,38.42 U1.4
N$8  (via drill 0.35)
  Top 0.152: IC31.15 v60.64,49.85 | IC22.1 71.71,46.67 v71.75,46.67
  Bottom 0.152: v71.75,46.67 63.82,46.67 v60.64,49.85
N$9  (via drill 0.35)
  Top 0.152: v72.75,83.26 74.83,83.26 IC30.18
  Bottom 0.152: TP1.TP 70.25,83.26 v72.75,83.26
N$10
  Top 0.152: IC29.19 75.94,94.03 77.31,95.41 77.31,97 77.79,97.47 R1.1
N$11  (via drill 0.35)
  Top 0.152: 74.93,53.7 IC22.9 74.93,53.7 | IC31.7 v66.99,51.12 | v74.93,51.12 74.93,53.7
  Bottom 0.152: v66.99,51.12 v74.93,51.12
N$12
  Top 0.152: IC29.18 75.92,93.38 77.95,95.41 R2.1
N$13
  Top 0.152: IC29.17 77.02,92.73 77.63,93.34 R3.1
N$14
  Top 0.152: IC29.16 76.99,92.08 77.79,91.28 R4.1
N$15
  Top 0.152: IC29.15 76.68,91.43 77.47,90.65 77.47,89.53 77.79,89.22 R5.1
N$16
  Top 0.152: IC29.14 76.38,90.78 77.17,90 77.17,87.62 77.63,87.15 R6.1
N$17  (via drill 0.35)
  Top 0.152: IC31.9 v68.26,52.31 | v75.49,52.23 75.49,50.88 74.31,49.7 IC22.5
  Bottom 0.152: v68.26,52.31 75.41,52.31 v75.49,52.23
N$18
  Top 0.152: IC29.13 76.08,90.13 76.86,89.35 76.86,85.86 77.63,85.09 R7.1
N$19
  Top 0.152: IC29.12 75.78,89.48 76.56,88.7 76.56,84.1 77.63,83.03 R8.1
N$20  (via drill 0.35)
  Top 0.152: IC22.3 73.03,47.86 v73.03,46.67 | v61.91,49.77 IC31.14
  Bottom 0.152: v61.91,49.77 62.07,49.61 64.29,47.39 72.31,47.39 v73.03,46.67
N$21  (via drill 0.35)
  Top 0.152: v73.5,82.55 74.85,82.55 IC30.17
  Bottom 0.152: TP2.TP v73.5,82.55
N$22  (via drill 0.35)
  Top 0.152: v72.75,81.92 v72.76,81.92 IC30.16
  Bottom 0.152: TP3.TP 70.33,81.92 v72.75,81.92
N$23  (via drill 0.35)
  Top 0.152: v73.5,81.28 IC30.15
  Bottom 0.152: TP4.TP 71.28,81.28 v73.5,81.28
N$24  (via drill 0.35)
  Top 0.152: v72.75,80.64 74.85,80.64 IC30.14
  Bottom 0.152: TP5.TP 72.55,80.64 v72.75,80.64
O0
  Bottom 0.152: I/O.1 91.76,90.01 90.22,88.48 IC35.2
O1
  Bottom 0.152: I/O.2 93.98,88.74 91.28,88.74 90.37,87.83 IC35.3
O2
  Bottom 0.152: I/O.3 90.81,87.47 90.49,87.15 89.18,87.15 IC35.4
O3
  Bottom 0.152: I/O.4 93.98,86.2 92.08,86.2 91.75,86.53 IC35.5
O4
  Bottom 0.152: IC35.6 91.76,85.88 I/O.5
O5
  Bottom 0.152: I/O.6 93.98,83.66 92.08,83.66 90.51,85.23 IC35.7
O6
  Bottom 0.152: I/O.7 90.53,84.58 IC35.8
O7
  Bottom 0.152: I/O.8 93.98,81.12 92.08,81.12 91.44,81.76 91.44,82.87 90.38,83.93 IC35.9
O8
  Bottom 0.152: IC36.2 91.33,78.32 92.71,79.69 I/O.9
O9
  Bottom 0.152: I/O.10 93.98,78.58 92.08,78.58 91.16,77.67 IC36.3
O10
  Bottom 0.152: IC36.4 89.18,76.99 92.39,76.99 I/O.11
O11
  Bottom 0.152: I/O.12 93.98,76.04 92.08,76.04 91.75,76.37 IC36.5
O12
  Bottom 0.152: IC36.6 91.77,75.72 I/O.13
O13
  Bottom 0.152: I/O.14 93.98,73.5 92.08,73.5 90.51,75.07 IC36.7
O14
  Bottom 0.152: IC36.8 90.53,74.42 I/O.15
O15
  Bottom 0.152: I/O.16 93.98,70.96 92.08,70.96 91.44,71.6 91.44,72.87 90.54,73.77 IC36.9
O16
  Top 0.152: IC33.19 91.17,68.16 I/O.17
O17
  Top 0.152: I/O.18 93.98,68.42 92.08,68.42 91.16,67.51 IC33.18
O18
  Top 0.152: I/O.19 91.6,67.15 91.3,66.86 IC33.17
O19
  Top 0.152: I/O.20 93.98,65.88 92.08,65.88 91.75,66.21 IC33.16
O20
  Top 0.152: I/O.21 91.77,65.56 IC33.15
O21
  Top 0.152: I/O.22 94.46,64.61 93.19,63.34 91.28,63.34 89.72,64.91 IC33.14
O22
  Top 0.152: I/O.23 91.92,62.07 89.73,64.26 IC33.13
O23
  Top 0.152: I/O.24 93.98,60.8 92.08,60.8 91.44,61.44 91.44,61.75 89.59,63.61 IC33.12
O24
  Top 0.152: I/O.25 91.12,57.94 88.42,57.94 IC34.19
O25
  Top 0.152: I/O.26 93.98,58.26 92.08,58.26 91.16,57.35 IC34.18
O26
  Top 0.152: I/O.27 91.44,56.99 91.14,56.7 IC34.17
O27
  Top 0.152: I/O.28 93.98,55.72 92.23,55.72 91.91,56.05 IC34.16
O28
  Top 0.152: IC34.15 91.77,55.4 I/O.29
O29
  Top 0.152: I/O.30 93.98,53.18 91.28,53.18 89.72,54.75 IC34.14
O30
  Top 0.152: I/O.31 91.92,51.91 89.73,54.1 IC34.13
O31
  Top 0.152: I/O.32 93.98,50.64 92.08,50.64 91.44,51.28 91.44,51.44 89.43,53.45 IC34.12
OUTP_CLK_0  (via drill 0.35)
  Top 0.152: IC29.11 74.87,86.3 v74.77,86.2 | v67.79,84.93 66.36,83.5 v66.36,49.69 | v72.23,49.69 72.36,49.56 IC22.2
  Bottom 0.152: v74.77,86.2 69.06,86.2 v67.79,84.93 | v66.36,49.69 v72.23,49.69
OUTP_CLK_1  (via drill 0.35)
  Top 0.152: IC30.11 74.87,77.77 v75.09,77.55 | v67.15,78.11 66.66,77.62 66.66,56.53 67.63,55.56 v67.63,46.04 | v73.98,46.67 73.66,46.99 IC22.4
  Bottom 0.152: v75.09,77.55 74.53,78.11 v67.15,78.11 | v73.98,46.67 73.34,46.04 v67.63,46.04
OUTP_CLK_2  (via drill 0.35)
  Top 0.152: IC33.11 88.37,62.13 v88.42,62.07 | v86.04,62.07 86.04,50.88 v86.36,50.56 | v74.93,49.37 74.96,49.34 IC22.6
  Bottom 0.152: v88.42,62.07 v86.04,62.07 | v86.36,50.56 85.72,49.93 75.48,49.93 v74.93,49.37
OUTP_CLK_3  (via drill 0.35)
  Top 0.152: IC34.11 88.37,50.54 v88.42,50.48 | v76.52,52.07 76.47,52.07 75.61,52.93 IC22.8
  Bottom 0.152: v88.42,50.48 87.79,51.12 81.76,51.12 81.28,50.64 77.95,50.64 v76.52,52.07
SEG_A  (via drill 0.35)
  Top 0.152: R1.2 81.6,97.47 83.64,95.43 83.64,79.72 v83.66,79.69 | v76.99,79.85 76.99,74.98 U$1.P$4
  Bottom 0.152: v83.66,79.69 82.07,79.69 81.92,79.85 v76.99,79.85
SEG_B  (via drill 0.35)
  Top 0.152: R2.2 81.76,95.41 83.33,93.83 83.33,80.74 v82.97,80.38 | v79.13,80.49 79.13,78.03 79.43,77.73 U$1.P$5
  Bottom 0.152: v79.13,80.49 79.24,80.38 v82.97,80.38
SEG_C  (via drill 0.35)
  Top 0.152: R3.2 81.76,93.34 83.03,92.08 83.03,81.86 81.89,80.72 81.89,71.98 81.25,71.34 81.25,54.43 81.57,54.11 81.57,52.18 v80.64,51.25 | v76.94,54.87 76.94,57.74 U$1.P$9
  Bottom 0.152: v80.64,51.25 77.02,54.87 v76.94,54.87
SEG_D  (via drill 0.35)
  Top 0.152: R4.2 81.6,91.28 82.68,90.19 82.68,81.95 81.58,80.85 81.58,72.11 80.95,71.47 80.95,54.3 81.27,53.99 81.27,52.68 v80.64,52.06 | v70.48,55.24 70.48,55.4 71.81,56.73 U$1.P$7
  Bottom 0.152: v80.64,52.06 80.55,52.06 77.04,55.56 70.8,55.56 v70.48,55.24
SEG_DP
  Top 0.152: R8.2 80.64,81.76 79.69,80.8 79.69,77.95 80.8,76.83 80.8,72.23 79.43,70.86 U$1.P$10
SEG_E  (via drill 0.35)
  Top 0.152: R5.2 81.76,89.22 82.07,88.9 82.38,88.59 82.38,86.2 82.38,82.07 81.28,80.98 81.28,72.23 80.64,71.6 v80.64,52.86 | v67.63,56.91 68.4,56.91 U$1.P$6
  Bottom 0.152: v80.64,52.86 80.17,52.86 76.12,56.91 v67.63,56.91
SEG_F  (via drill 0.35)
  Top 0.152: R6.2 81.6,87.15 82.07,86.68 82.07,82.2 80.72,80.85 v80.72,78.66 | v71.91,77.47 71.91,74.98 U$1.P$2
  Bottom 0.152: v71.91,77.47 72.39,76.99 78.51,76.99 80.17,78.66 v80.72,78.66
SEG_G  (via drill 0.35)
  Top 0.152: R7.2 81.44,85.09 81.76,84.77 81.76,82.31 80.09,80.64 80.09,78.42 v80.72,77.79 | v69.37,77.47 69.27,77.37 U$1.P$1
  Bottom 0.152: v80.72,77.79 79.61,76.68 70.17,76.68 v69.37,77.47
STR  (via drill 0.35)
  Top 0.152: v73.34,41.83 71.21,43.96 66.53,43.96 65.72,44.77 IC31.6
  Top 0.305: JP4.7 JP2.7
  Bottom 0.152: JP4.7 74.61,30.8 73.97,31.45 73.97,39.62 74.2,39.86 74.2,40.97 v73.34,41.83
TO_SP  (via drill 0.35)
  Top 0.152: v73.66,49.37 IC22.11 | v74.78,46.67 74.78,46.35 73.34,44.91 v73.34,42.64
  Top 0.305: JP4.9 JP2.9
  Bottom 0.152: JP4.9 74.61,35.88 74.27,36.22 74.27,39.5 74.51,39.73 74.51,41.47 v73.34,42.64 | v73.66,49.37 74.78,48.25 v74.78,46.67
UPPER_BIT  (via drill 0.35)
  Top 0.152: IC8.1 37.07,38.49 v36.99,38.58 | v37.7,42.7 39.13,41.27 42.7,41.27 42.86,41.43 U1.1
  Bottom 0.152: v36.99,38.58 37.7,39.29 v37.7,42.7
V0  (via drill 0.35)
  Top 0.152: IC24.1 6.35,13.22 v7.46,13.22 7.46,14.49 8.73,15.76 8.73,20.95 10.16,22.38 IC16.14 | IC26.4 27.23,7.78 v27.78,8.34 | v37.94,8.41 37.31,7.78 IC27.4 | v9.05,8.59 v9.05,12.7
  Bottom 0.152: v37.94,8.41 37.86,8.34 v27.78,8.34 19.37,8.34 19.21,8.18 10.73,8.18 10.32,8.59 v9.05,8.59 | v7.46,13.22 7.98,12.7 v9.05,12.7
V1  (via drill 0.35)
  Top 0.152: IC16.13 v10,21.11 | v3.56,21.11 3.56,21.05 3.81,20.8 3.81,17.71 3.32,17.22 3.32,13.51 4.92,11.91 5.79,11.91 IC24.3
  Bottom 0.152: v10,21.11 v3.56,21.11
V2  (via drill 0.35)
  Top 0.152: IC2.10 v35.4,77.47 | v11.59,78.58 IC1.10 | IC4.10 v35.4,53.66 | v11.59,54.77 IC3.10 | v1.91,79.08 3.07,77.92 3.07,75.98 2.82,75.73 2.82,55.52 3.06,55.29 | 3.06,55.29 v3.07,55.27 | IC24.5 4.94,10.62 2.7,12.86 v2.7,19.84 2.7,26.19 3.79,27.28 3.79,29.1 2.82,30.07 2.82,51.8 3.32,52.31 3.32,55.02 3.06,55.29 | IC16.12 v10,19.84 | IC28.6 v34.45,17.3 34.45,16.19 34.29,16.03 34.29,5.71 34.77,5.24 IC27.6
  Bottom 0.152: v35.4,77.47 34.54,78.33 11.84,78.33 v11.59,78.58 11.09,79.08 v1.91,79.08 | v35.4,53.66 34.54,54.52 11.84,54.52 v11.59,54.77 3.57,54.77 v3.07,55.27 | v2.7,19.84 v10,19.84 16.35,19.84 18.26,17.94 32.86,17.94 33.5,17.3 v34.45,17.3
V3  (via drill 0.35)
  Top 0.152: IC2.11 v36.67,77.47 | v12.86,78.89 IC1.11 | IC4.11 v36.67,53.66 | v12.86,55.07 IC3.11 | v1.91,79.89 3.38,78.42 3.38,75.86 3.12,75.61 3.12,56.33 v3.38,56.08 3.63,55.83 3.63,52.18 3.12,51.68 3.12,30.19 4.09,29.23 4.09,27.15 3,26.07 3,20.64 3.25,20.39 v3.25,18.57 | IC16.11 v10,18.57 10,9.97 | 10,9.97 IC24.9 | IC25.11 v20,7.78 | v30.16,7.78 IC26.11 | v10,7.78 10,9.97 | v40.48,7.78 IC27.11
  Bottom 0.152: v36.67,77.47 35.51,78.64 13.11,78.64 v12.86,78.89 11.85,79.89 v1.91,79.89 | v36.67,53.66 35.51,54.82 13.11,54.82 v12.86,55.07 12.53,55.4 4.05,55.4 v3.38,56.08 | v3.25,18.57 v10,18.57 | v10,7.78 v20,7.78 v30.16,7.78 v40.48,7.78
V4  (via drill 0.35)
  Top 0.152: IC2.12 v37.94,77.47 | v14.13,79.19 IC1.12 | IC4.12 v37.94,53.66 | v14.13,55.38 IC3.12 | v1.91,80.7 3.68,78.92 3.68,75.73 3.43,75.48 3.43,57.14 v3.68,56.89 3.93,56.63 3.93,52.05 3.43,51.55 3.43,30.32 4.39,29.35 4.39,27.03 3.31,25.94 3.31,22.64 v3.56,22.38 | IC17.14 v19.84,22.38 19.84,12.06 v20.32,11.59 | v17.62,11.59 IC25.1 | v27.78,11.59 IC26.1 | v37.94,11.59 IC27.1 | v34.13,22.38 34.13,22.92 34.87,23.65 IC28.1
  Bottom 0.152: v37.94,77.47 36.47,78.94 14.38,78.94 v14.13,79.19 12.62,80.7 v1.91,80.7 | v37.94,53.66 36.47,55.13 14.38,55.13 v14.13,55.38 13.8,55.71 4.86,55.71 v3.68,56.89 | v3.56,22.38 v19.84,22.38 v34.13,22.38 | v17.62,11.59 v20.32,11.59 v27.78,11.59 v37.94,11.59
V5  (via drill 0.35)
  Top 0.152: IC2.13 v39.21,77.47 | v15.4,79.5 IC1.13 | IC4.13 v39.21,53.66 | v15.4,55.68 IC3.13 | v1.91,81.51 3.98,79.43 3.98,75.6 3.73,75.35 3.73,57.95 v3.98,57.69 4.24,57.44 4.24,51.93 3.73,51.43 3.73,30.44 5.03,29.15 v5.03,27.87 | IC17.13 v23.65,21.11 | v43.97,21.11 IC28.12 | v23.65,21.11 v23.65,12.14 | v12.7,12.06 12.7,11.59 12.38,11.27 IC24.11 | v23.65,27.87 v23.65,21.11
  Bottom 0.152: v39.21,77.47 37.44,79.25 15.65,79.25 v15.4,79.5 13.39,81.51 v1.91,81.51 | v39.21,53.66 37.44,55.43 15.65,55.43 v15.4,55.68 15.07,56.01 6.99,56.01 5.67,56.01 v3.98,57.69 | v23.65,21.11 v43.97,21.11 | v23.65,12.14 12.78,12.14 v12.7,12.06 | v23.65,27.87 23.5,28.03 5.19,28.03 v5.03,27.87
V6  (via drill 0.35)
  Top 0.152: IC2.14 v40.48,77.47 | v16.67,79.8 IC1.14 | IC4.14 v40.48,53.66 | v16.67,55.99 IC3.14 | v1.91,82.31 4.29,79.93 4.29,75.48 4.04,75.23 4.04,58.75 v4.29,58.5 4.54,58.25 4.54,51.8 4.04,51.3 4.04,30.57 5.59,29.02 5.59,27.57 v5.08,27.07 | v18.57,27.48 18.57,19.92 v18.65,19.84 | v20.4,19.84 IC17.12 | v39.13,19.29 39.13,20.72 37.47,22.38 IC28.2 | IC25.2 v17.62,10.32 | v27.78,10.41 27.69,10.32 IC26.2 | v37.94,10.41 37.85,10.32 IC27.2 | v24.29,19.21 v24.29,10.32
  Bottom 0.152: v40.48,77.47 38.4,79.55 16.92,79.55 v16.67,79.8 14.16,82.31 v1.91,82.31 | v40.48,53.66 38.73,55.4 38.4,55.74 16.92,55.74 v16.67,55.99 16.34,56.32 6.47,56.32 v4.29,58.5 | v5.08,27.07 5.74,27.73 18.32,27.73 v18.57,27.48 | v18.65,19.84 v20.4,19.84 21.04,19.21 v24.29,19.21 39.05,19.21 v39.13,19.29 | v17.62,10.32 v24.29,10.32 27.69,10.32 v27.78,10.41 32.38,10.41 v37.94,10.41
V7  (via drill 0.35)
  Top 0.152: IC2.15 v41.75,77.47 | v17.94,80.11 IC1.15 | IC4.15 v41.75,53.66 | v17.94,56.29 IC3.15 | v1.91,83.12 4.59,80.43 4.59,75.35 4.34,75.1 4.34,59.56 v4.59,59.31 4.85,59.06 4.85,51.68 4.34,51.17 4.34,30.7 5.89,29.15 5.89,27.07 v5.08,26.26 | v17.77,27.17 18.27,26.67 18.27,20.72 18.1,20.55 18.1,19.13 v18.65,18.57 | v20.4,18.57 IC17.11
  Bottom 0.152: v41.75,77.47 39.37,79.86 18.19,79.86 v17.94,80.11 14.92,83.12 v1.91,83.12 | v41.75,53.66 39.37,56.04 18.19,56.04 v17.94,56.29 17.61,56.62 7.28,56.62 v4.59,59.31 | v17.77,27.17 17.52,27.42 6.24,27.42 v5.08,26.26 | v18.65,18.57 v20.4,18.57
V8  (via drill 0.35)
  Top 0.152: IC2.16 v43.02,77.47 | v19.21,80.41 IC1.16 | IC4.16 v43.02,53.66 | v19.21,56.6 IC3.16 | v1.91,83.93 4.9,80.93 4.9,75.22 4.65,74.97 4.65,60.37 v4.9,60.12 5.15,59.86 5.15,51.55 4.65,51.05 4.65,30.82 6.2,29.27 6.2,27.3 6.2,26.59 v5.89,26.28 | v30.16,26.83 30.16,22.7 30.48,22.38 IC18.14
  Bottom 0.152: v43.02,77.47 40.33,80.16 19.46,80.16 v19.21,80.41 15.69,83.93 v1.91,83.93 | v43.02,53.66 40.33,56.35 19.46,56.35 v19.21,56.6 18.88,56.93 8.09,56.93 v4.9,60.12 | v5.89,26.28 6.72,27.12 16.88,27.12 17.38,26.61 18.66,26.61 19.32,27.28 29.71,27.28 v30.16,26.83
V9  (via drill 0.35)